# EAGLE schematic C64_3 (EAGLE 5.12)

## Sheet 1 of 3
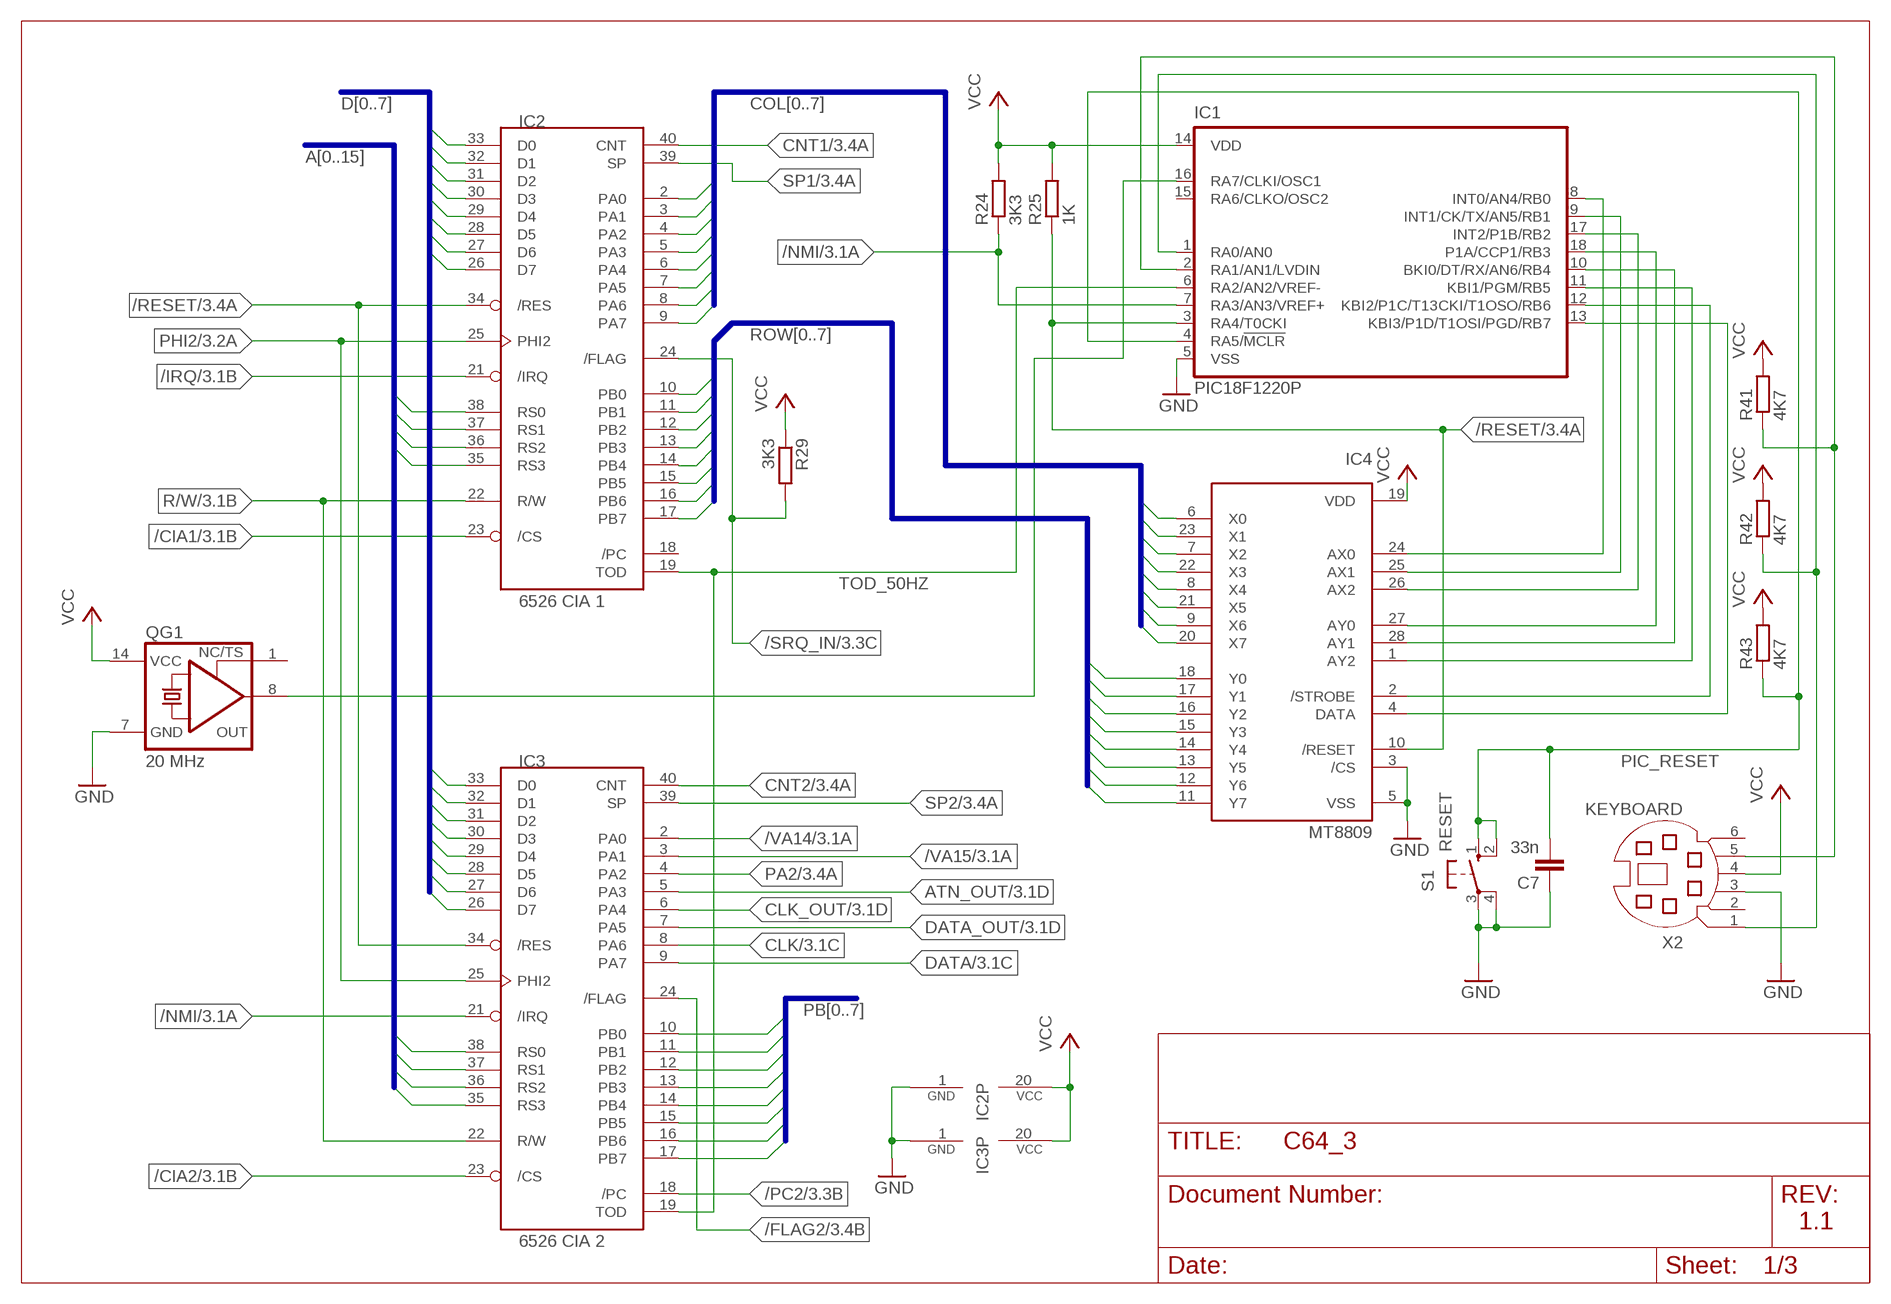
[diagram p0: schematic, sheet 1]

### Parts
C7  33n  C-EU050-024X044  [C050-024X044]
IC1  PIC18F1220P  [DIL18]
IC2  6526 CIA 1  6526  [DIP40]
IC3  6526 CIA 2  6526  [DIP40]
IC4  MT8809  [S28]
QG1  20 MHz  XO-14  [DIL14S]
R24  3K3  R-EU_0207/2V  [0207/2V]
R25  1K  R-EU_0207/2V  [0207/2V]
R29  3K3  R-EU_0207/2V  [0207/2V]
R41  4K7  R-EU_0207/2V  [0207/2V]
R42  4K7  R-EU_0207/2V  [0207/2V]
R43  4K7  R-EU_0207/2V  [0207/2V]
S1  RESET  10-XX  [B3F-10XX]
X2  KEYBOARD  MD06SS  [MDIN06SS]

### Nets
/CIA1: IC2.23(/CS) ; also sheet 3
/CIA2: IC3.23(/CS) ; also sheet 3
/FLAG2: IC3.24(/FLAG) ; also sheet 3
/IRQ: IC2.21(/IRQ) ; also sheet 3
/NMI: IC1.7(RA3/AN3/VREF+) IC3.21(/IRQ) R24.1 ; also sheet 3
/PC2: IC3.18(/PC) ; also sheet 3
/RESET: IC1.3(RA4/T0CKI) IC2.34(/RES) IC3.34(/RES) IC4.10(/RESET) R25.1 ; also sheet 3
/SRQ_IN: IC2.24(/FLAG) R29.2 ; also sheet 3
/STROBE: IC1.12(KBI2/P1C/T13CKI/T1OSO/RB6) IC4.2(/STROBE)
/VA14: IC3.2(PA0) ; also sheet 3
/VA15: IC3.3(PA1) ; also sheet 3
A0: IC2.38(RS0) IC3.38(RS0) ; also sheet 3
A1: IC2.37(RS1) IC3.37(RS1) ; also sheet 3
A2: IC2.36(RS2) IC3.36(RS2) ; also sheet 3
A3: IC2.35(RS3) IC3.35(RS3) ; also sheet 3
ATN_OUT: IC3.5(PA3) ; also sheet 3
AX0: IC1.8(INT0/AN4/RB0) IC4.24(AX0)
AX1: IC1.9(INT1/CK/TX/AN5/RB1) IC4.25(AX1)
AX2: IC1.17(INT2/P1B/RB2) IC4.26(AX2)
AY0: IC1.18(P1A/CCP1/RB3) IC4.27(AY0)
AY1: IC1.10(BKI0/DT/RX/AN6/RB4) IC4.28(AY1)
AY2: IC1.11(KBI1/PGM/RB5) IC4.1(AY2)
CLK: IC3.8(PA6) ; also sheet 3
CLK_OUT: IC3.6(PA4) ; also sheet 3
CNT1: IC2.40(CNT) ; also sheet 3
CNT2: IC3.40(CNT) ; also sheet 3
COL0: IC2.2(PA0) IC4.6(X0) ; also sheet 2
COL1: IC2.3(PA1) IC4.23(X1) ; also sheet 2
COL2: IC2.4(PA2) IC4.7(X2) ; also sheet 2
COL3: IC2.5(PA3) IC4.22(X3) ; also sheet 2
COL4: IC2.6(PA4) IC4.8(X4) ; also sheet 2
COL5: IC2.7(PA5) IC4.21(X5)
COL6: IC2.8(PA6) IC4.9(X6) ; also sheet 2
COL7: IC2.9(PA7) IC4.20(X7) ; also sheet 2
D0: IC2.33(D0) IC3.33(D0) ; also sheet 3
D1: IC2.32(D1) IC3.32(D1) ; also sheet 3
D2: IC2.31(D2) IC3.31(D2) ; also sheet 3
D3: IC2.30(D3) IC3.30(D3) ; also sheet 3
D4: IC2.29(D4) IC3.29(D4) ; also sheet 3
D5: IC2.28(D5) IC3.28(D5) ; also sheet 3
D6: IC2.27(D6) IC3.27(D6) ; also sheet 3
D7: IC2.26(D7) IC3.26(D7) ; also sheet 3
DATA: IC3.9(PA7) ; also sheet 3
DATA_OUT: IC3.7(PA5) ; also sheet 3
GND: C7.1 IC1.5(VSS) IC2.1(GND) IC3.1(GND) IC4.3(/CS) IC4.5(VSS) QG1.7(GND) S1.3(P) S1.4(P1) X2.3 ; also sheet 2,3
KB_CLOCK: IC1.2(RA1/AN1/LVDIN) R41.1 X2.5
KB_DATA: IC1.1(RA0/AN0) R42.1 X2.1
PA2: IC3.4(PA2) ; also sheet 3
PB0: IC3.10(PB0) ; also sheet 3
PB1: IC3.11(PB1) ; also sheet 3
PB2: IC3.12(PB2) ; also sheet 3
PB3: IC3.13(PB3) ; also sheet 3
PB4: IC3.14(PB4) ; also sheet 3
PB5: IC3.15(PB5) ; also sheet 3
PB6: IC3.16(PB6) ; also sheet 3
PB7: IC3.17(PB7) ; also sheet 3
PHI2: IC2.25(PHI2) IC3.25(PHI2) ; also sheet 3
PIC_CLK: IC1.16(RA7/CLKI/OSC1) QG1.8(OUT)
PIC_RESET: C7.2 IC1.4(RA5/!MCLR) R43.1 S1.1(S) S1.2(S1)
R/W: IC2.22(R/W) IC3.22(R/W) ; also sheet 3
ROW0: IC2.10(PB0) IC4.18(Y0) ; also sheet 2
ROW1: IC2.11(PB1) IC4.17(Y1) ; also sheet 2
ROW2: IC2.12(PB2) IC4.16(Y2) ; also sheet 2
ROW3: IC2.13(PB3) IC4.15(Y3) ; also sheet 2
ROW4: IC2.14(PB4) IC4.14(Y4) ; also sheet 2,3
ROW5: IC2.15(PB5) IC4.13(Y5)
ROW6: IC2.16(PB6) IC4.12(Y6)
ROW7: IC2.17(PB7) IC4.11(Y7)
SP1: IC2.39(SP) ; also sheet 3
SP2: IC3.39(SP) ; also sheet 3
SW_DATA: IC1.13(KBI3/P1D/T1OSI/PGD/RB7) IC4.4(DATA)
TOD_50HZ: IC1.6(RA2/AN2/VREF-) IC2.19(TOD) IC3.19(TOD)
VCC: IC1.14(VDD) IC2.20(VCC) IC3.20(VCC) IC4.19(VDD) QG1.14(VCC) R24.2 R25.2 R29.1 R41.2 R42.2 R43.2 X2.4 ; also sheet 2,3
Unconnected: IC1.15(RA6/CLKO/OSC2) IC2.18(/PC) QG1.1(TS) X2.2 X2.6

### Buses
D[0..7]
A[0..15]
COL[0..7]
ROW[0..7]
PB[0..7]

### Notes on the sheet
- 1.1

## Sheet 2 of 3
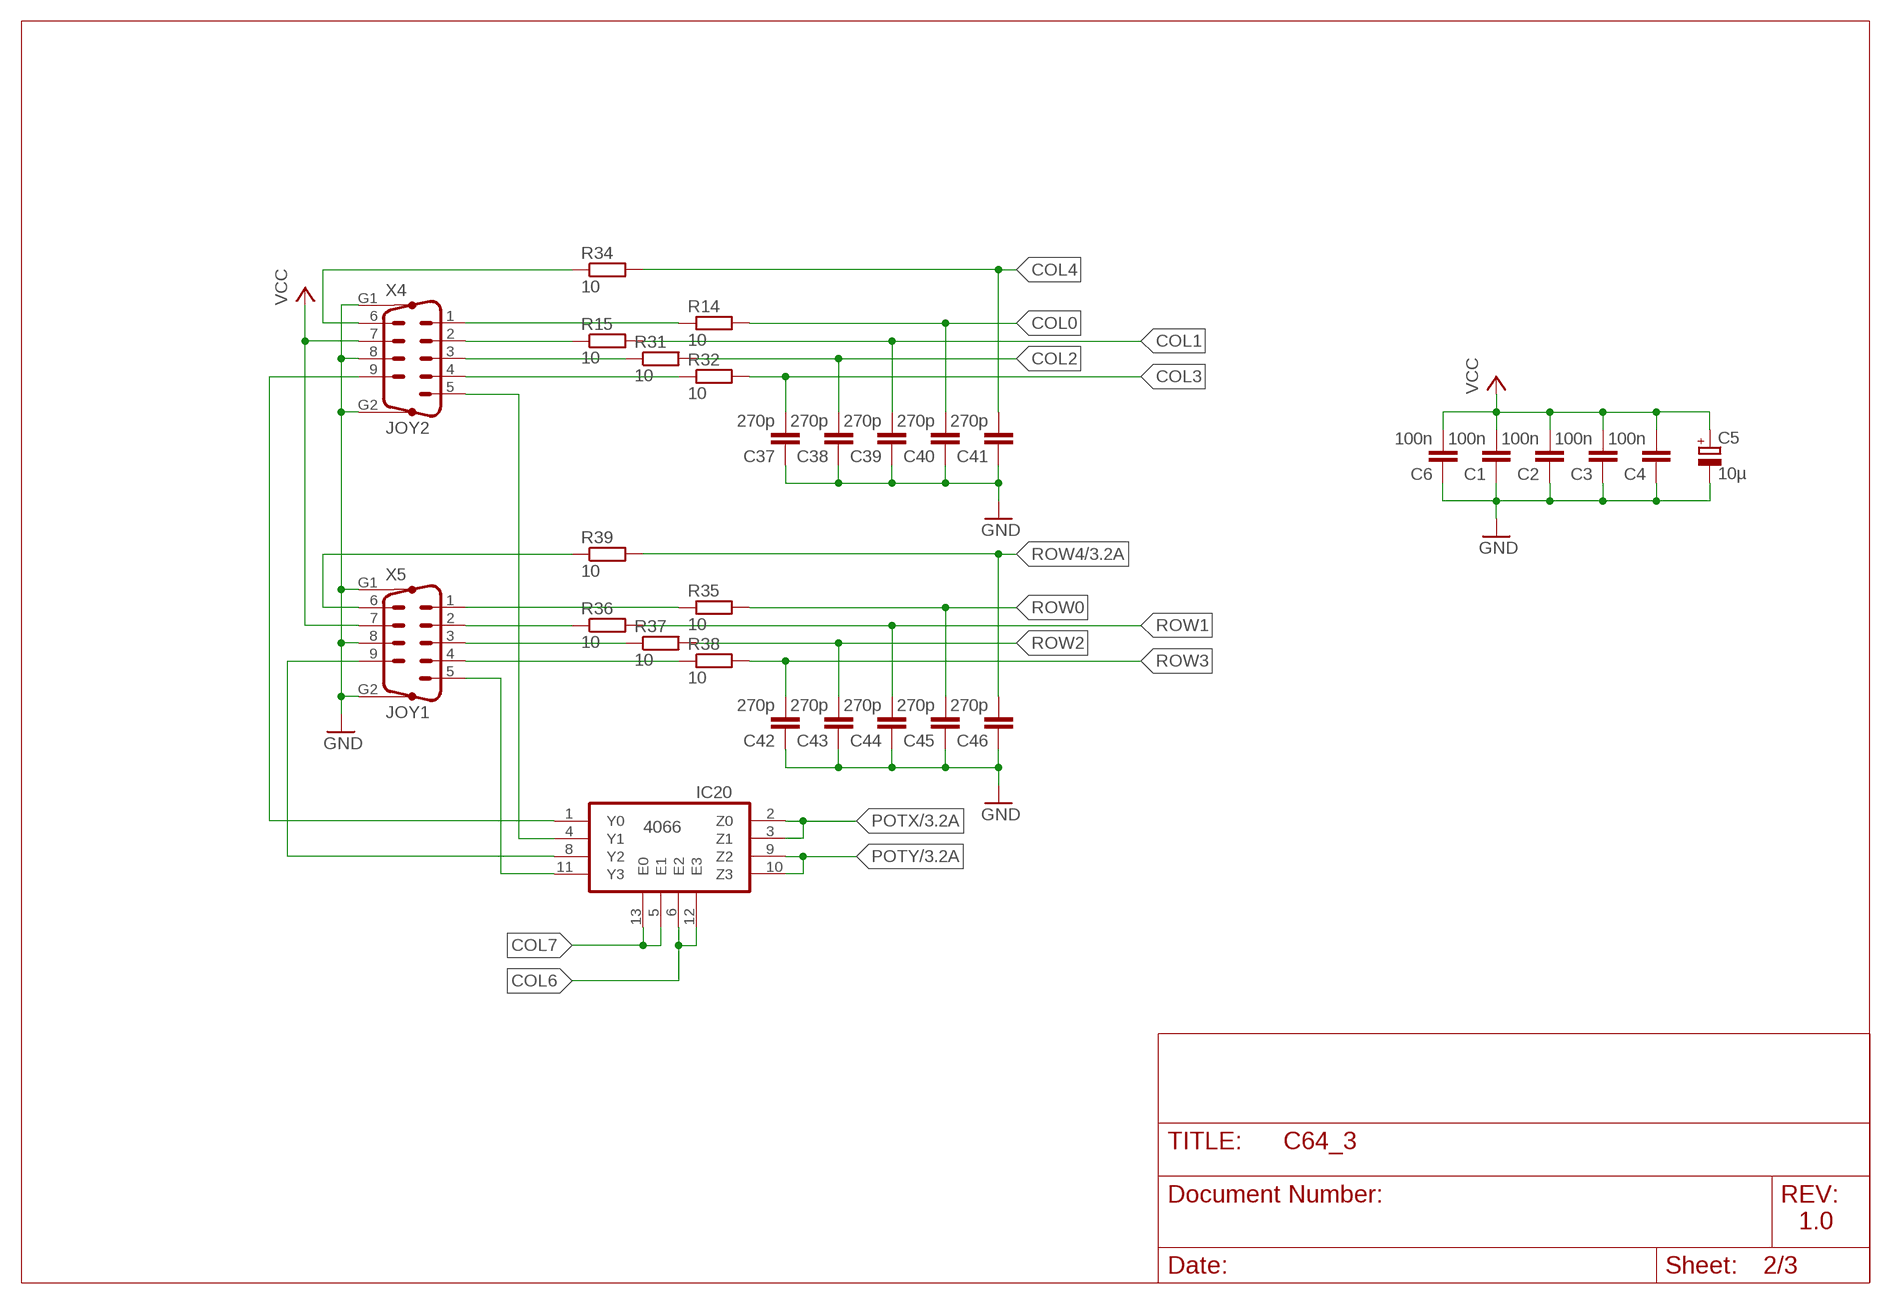
[diagram p1: schematic, sheet 2]

### Parts
C1  100n  C-EU050-024X044  [C050-024X044]
C2  100n  C-EU050-024X044  [C050-024X044]
C3  100n  C-EU050-024X044  [C050-024X044]
C4  100n  C-EU050-024X044  [C050-024X044]
C5  10µ  CPOL-EUE2.5-5  [E2,5-5]
C6  100n  C-EU050-024X044  [C050-024X044]
C37  270p  C-EU050-024X044  [C050-024X044]
C38  270p  C-EU050-024X044  [C050-024X044]
C39  270p  C-EU050-024X044  [C050-024X044]
C40  270p  C-EU050-024X044  [C050-024X044]
C41  270p  C-EU050-024X044  [C050-024X044]
C42  270p  C-EU050-024X044  [C050-024X044]
C43  270p  C-EU050-024X044  [C050-024X044]
C44  270p  C-EU050-024X044  [C050-024X044]
C45  270p  C-EU050-024X044  [C050-024X044]
C46  270p  C-EU050-024X044  [C050-024X044]
IC20  4066  [DIL14]
R14  10  R-EU_0207/2V  [0207/2V]
R15  10  R-EU_0207/2V  [0207/2V]
R31  10  R-EU_0207/2V  [0207/2V]
R32  10  R-EU_0207/2V  [0207/2V]
R34  10  R-EU_0207/2V  [0207/2V]
R35  10  R-EU_0207/2V  [0207/2V]
R36  10  R-EU_0207/2V  [0207/2V]
R37  10  R-EU_0207/2V  [0207/2V]
R38  10  R-EU_0207/2V  [0207/2V]
R39  10  R-EU_0207/2V  [0207/2V]
X4  JOY2  M09HP  [M09HP]
X5  JOY1  M09HP  [M09HP]

### Nets
BNTB: R34.1 X4.6
BTNA: R39.1 X5.6
COL0: C40.2 R14.2 ; also sheet 1
COL1: C39.2 R15.2 ; also sheet 1
COL2: C38.2 R31.2 ; also sheet 1
COL3: C37.2 R32.2 ; also sheet 1
COL4: C41.2 R34.2 ; also sheet 1
COL6: IC20.6(E2) IC20.12(E3) ; also sheet 1
COL7: IC20.5(E1) IC20.13(E0) ; also sheet 1
GND: C1.1 C2.1 C3.1 C4.1 C5.- C6.1 C37.1 C38.1 C39.1 C40.1 C41.1 C42.1 C43.1 C44.1 C45.1 C46.1 X4.8 X4.G1 X4.G2 X5.8 X5.G1 X5.G2 ; also sheet 1,3
JOYA0: R35.1 X5.1
JOYA1: R36.1 X5.2
JOYA2: R37.1 X5.3
JOYA3: R38.1 X5.4
JOYB0: R14.1 X4.1
JOYB1: R15.1 X4.2
JOYB2: R31.1 X4.3
JOYB3: R32.1 X4.4
POTAX: IC20.11(Y3) X5.5
POTAY: IC20.8(Y2) X5.9
POTBX: IC20.4(Y1) X4.5
POTBY: IC20.1(Y0) X4.9
POTX: IC20.2(Z0) IC20.3(Z1) ; also sheet 3
POTY: IC20.9(Z2) IC20.10(Z3) ; also sheet 3
ROW0: C45.2 R35.2 ; also sheet 1
ROW1: C44.2 R36.2 ; also sheet 1
ROW2: C43.2 R37.2 ; also sheet 1
ROW3: C42.2 R38.2 ; also sheet 1
ROW4: C46.2 R39.2 ; also sheet 1,3
VCC: C1.2 C2.2 C3.2 C4.2 C5.+ C6.2 X4.7 X5.7 ; also sheet 1,3

### Notes on the sheet
- 1.0

## Sheet 3 of 3
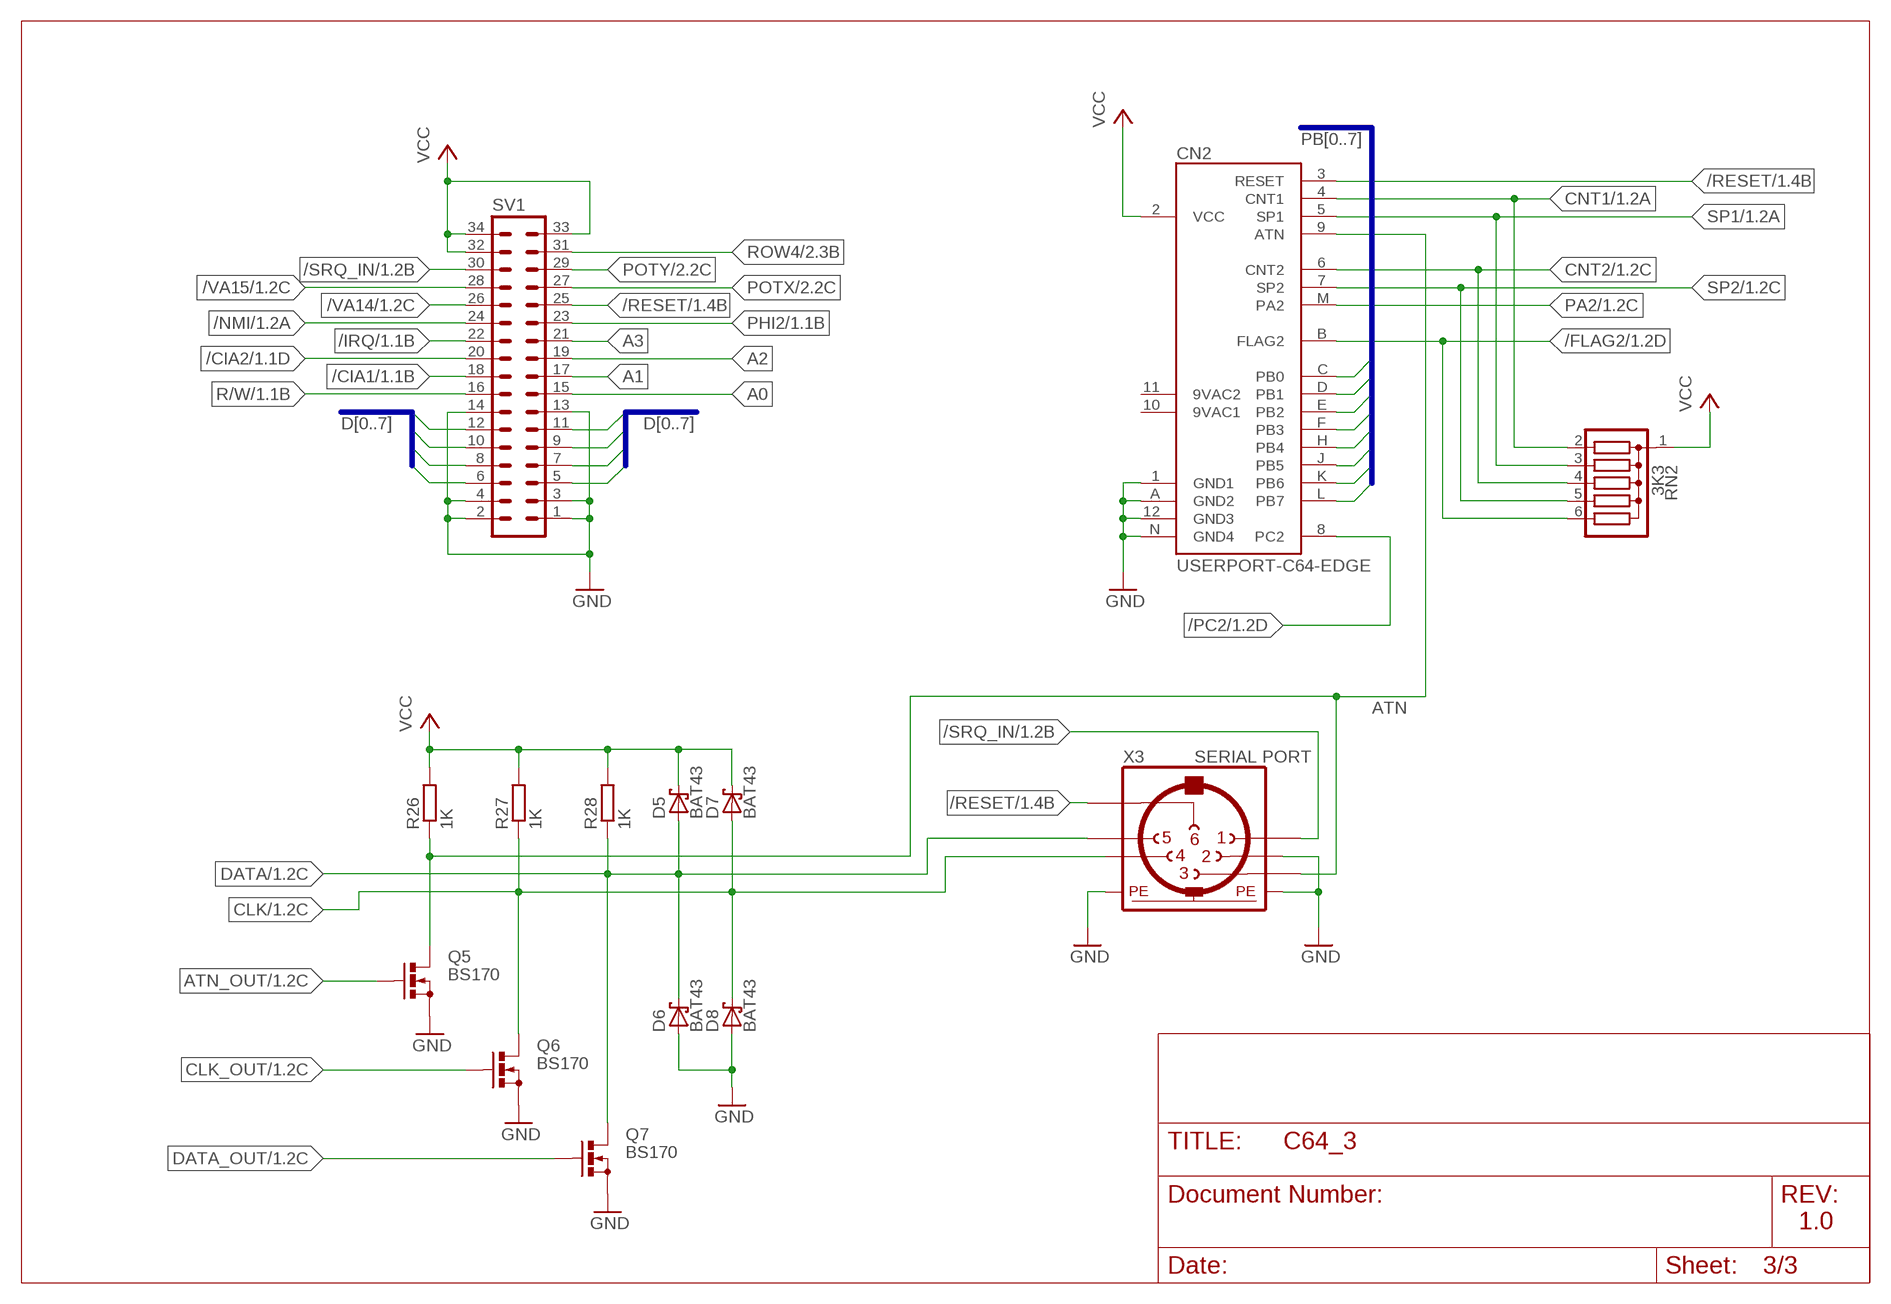
[diagram p2: schematic, sheet 3]

### Parts
CN2  USERPORT-C64-EDGE  [UPS24EDGE]
D5  BAT43  SCHOTTKY-DIODEDO35-7  [DO35-7]
D6  BAT43  SCHOTTKY-DIODEDO35-7  [DO35-7]
D7  BAT43  SCHOTTKY-DIODEDO35-7  [DO35-7]
D8  BAT43  SCHOTTKY-DIODEDO35-7  [DO35-7]
Q5  BS170  [SOT54E]
Q6  BS170  [SOT54E]
Q7  BS170  [SOT54E]
R26  1K  R-EU_0207/2V  [0207/2V]
R27  1K  R-EU_0207/2V  [0207/2V]
R28  1K  R-EU_0207/2V  [0207/2V]
RN2  3K3  G05R  [SIL6]
SV1  MA17-2  [MA17-2]
X3  SERIAL PORT  MAB6H  [MAB6H]

### Nets
/CIA1: SV1.18 ; also sheet 1
/CIA2: SV1.20 ; also sheet 1
/FLAG2: CN2.B(FLAG2) RN2.6 ; also sheet 1
/IRQ: SV1.22 ; also sheet 1
/NMI: SV1.24 ; also sheet 1
/PC2: CN2.8(PC2) ; also sheet 1
/RESET: CN2.3(RESET) SV1.25 X3.6 ; also sheet 1
/SRQ_IN: SV1.30 X3.1 ; also sheet 1
/VA14: SV1.26 ; also sheet 1
/VA15: SV1.28 ; also sheet 1
A0: SV1.15 ; also sheet 1
A1: SV1.17 ; also sheet 1
A2: SV1.19 ; also sheet 1
A3: SV1.21 ; also sheet 1
ATN: CN2.9(ATN) Q5.D R26.1 X3.3
ATN_OUT: Q5.G ; also sheet 1
CLK: D7.A D8.C Q6.D R27.1 X3.4 ; also sheet 1
CLK_OUT: Q6.G ; also sheet 1
CNT1: CN2.4(CNT1) RN2.2 ; also sheet 1
CNT2: CN2.6(CNT2) RN2.4 ; also sheet 1
D0: SV1.5 ; also sheet 1
D1: SV1.6 ; also sheet 1
D2: SV1.7 ; also sheet 1
D3: SV1.8 ; also sheet 1
D4: SV1.9 ; also sheet 1
D5: SV1.10 ; also sheet 1
D6: SV1.11 ; also sheet 1
D7: SV1.12 ; also sheet 1
DATA: D5.A D6.C Q7.D R28.1 X3.5 ; also sheet 1
DATA_OUT: Q7.G ; also sheet 1
GND: CN2.1(GND1) CN2.12(GND3) CN2.A(GND2) CN2.N(GND4) D6.A D8.A Q5.S Q6.S Q7.S SV1.1 SV1.2 SV1.3 SV1.4 SV1.13 SV1.14 X3.2 X3.PE X3.PE@(PE) ; also sheet 1,2
PA2: CN2.M(PA2) ; also sheet 1
PB0: CN2.C(PB0) ; also sheet 1
PB1: CN2.D(PB1) ; also sheet 1
PB2: CN2.E(PB2) ; also sheet 1
PB3: CN2.F(PB3) ; also sheet 1
PB4: CN2.H(PB4) ; also sheet 1
PB5: CN2.J(PB5) ; also sheet 1
PB6: CN2.K(PB6) ; also sheet 1
PB7: CN2.L(PB7) ; also sheet 1
PHI2: SV1.23 ; also sheet 1
POTX: SV1.27 ; also sheet 2
POTY: SV1.29 ; also sheet 2
R/W: SV1.16 ; also sheet 1
ROW4: SV1.31 ; also sheet 1,2
SP1: CN2.5(SP1) RN2.3 ; also sheet 1
SP2: CN2.7(SP2) RN2.5 ; also sheet 1
VCC: CN2.2(VCC) D5.C D7.C R26.2 R27.2 R28.2 RN2.1 SV1.32 SV1.33 SV1.34 ; also sheet 1,2
Unconnected: CN2.10(9VAC1) CN2.11(9VAC2)

### Buses
PB[0..7]
D[0..7]

### Notes on the sheet
- 1.0

## Power pins joined to a net without a drawn wire
GND: IC20.7(GND)
VCC: IC20.14(VCC)

## Library data of the parts
C1-C4 C6 C7 C37-C46 = rcl:C-EU: CAPACITOR, European symbol
C5 = rcl:CPOL-EU: POLARIZED CAPACITOR, European symbol
CN2 = 0RB_Commodore:USERPORT-C64-EDGE
D5-D8 = diode:SCHOTTKY-DIODE: Schottky Diode
IC1 = microchip:PIC18F1*20: 18/20/28-Pin High-Performance, Enhanced Flash Microcontrollers with 10-bit A/D and nanoWatt Technology Source: ww1.microchip.com/downloads/en/DeviceDoc/39605c.pdf; MF: MICROCHIP; MPN: PIC18F1220-I/P; OC_FARNELL: 9761977; OC_NEWARK: 92C2429
IC2 IC3 = 0RB_65xx:6526
IC4 = 0RB_CMOS:MT8809: Zarlink MT8809 8x8 Switch Array
IC20 = 0RB_CMOS:4066
Q5-Q7 = transistor-small-signal:BS170: N-CHANNEL MOS FET
QG1 = crystal:XO-: CRYSTAL; OC_FARNELL: unknown; OC_NEWARK: unknown
R14 R15 R24-R29 R31 R32 R34-R39 R41-R43 = rcl:R-EU_: RESISTOR, European symbol
RN2 = resistor-sil:G05R: SIL RESISTOR; OC_FARNELL: unknown; OC_NEWARK: unknown
S1 = switch-omron:10-XX: OMRON SWITCH; MPN: B3F-1000; OC_FARNELL: 176432; OC_NEWARK: 36M3542
SV1 = con-lstb:MA17-2: PIN HEADER; OC_FARNELL: unknown; OC_NEWARK: unknown
X2 = con-yamaichi:MD06SS: YAMAICHI CONNECTOR; OC_FARNELL: unknown; OC_NEWARK: unknown
X3 = con-hirschmann:MAB6H: Female CONNECTOR 6 pins with shield, horizontal (DIN 45322); MF: FARNELL; MPN: MAB 6 H; OC_FARNELL: 809901; OC_NEWARK: 67C7887
X4 X5 = con-subd:M09HP: SUB-D; OC_FARNELL: unknown; OC_NEWARK: unknown